# Altium project RBP-UPS_Power.PrjPcb
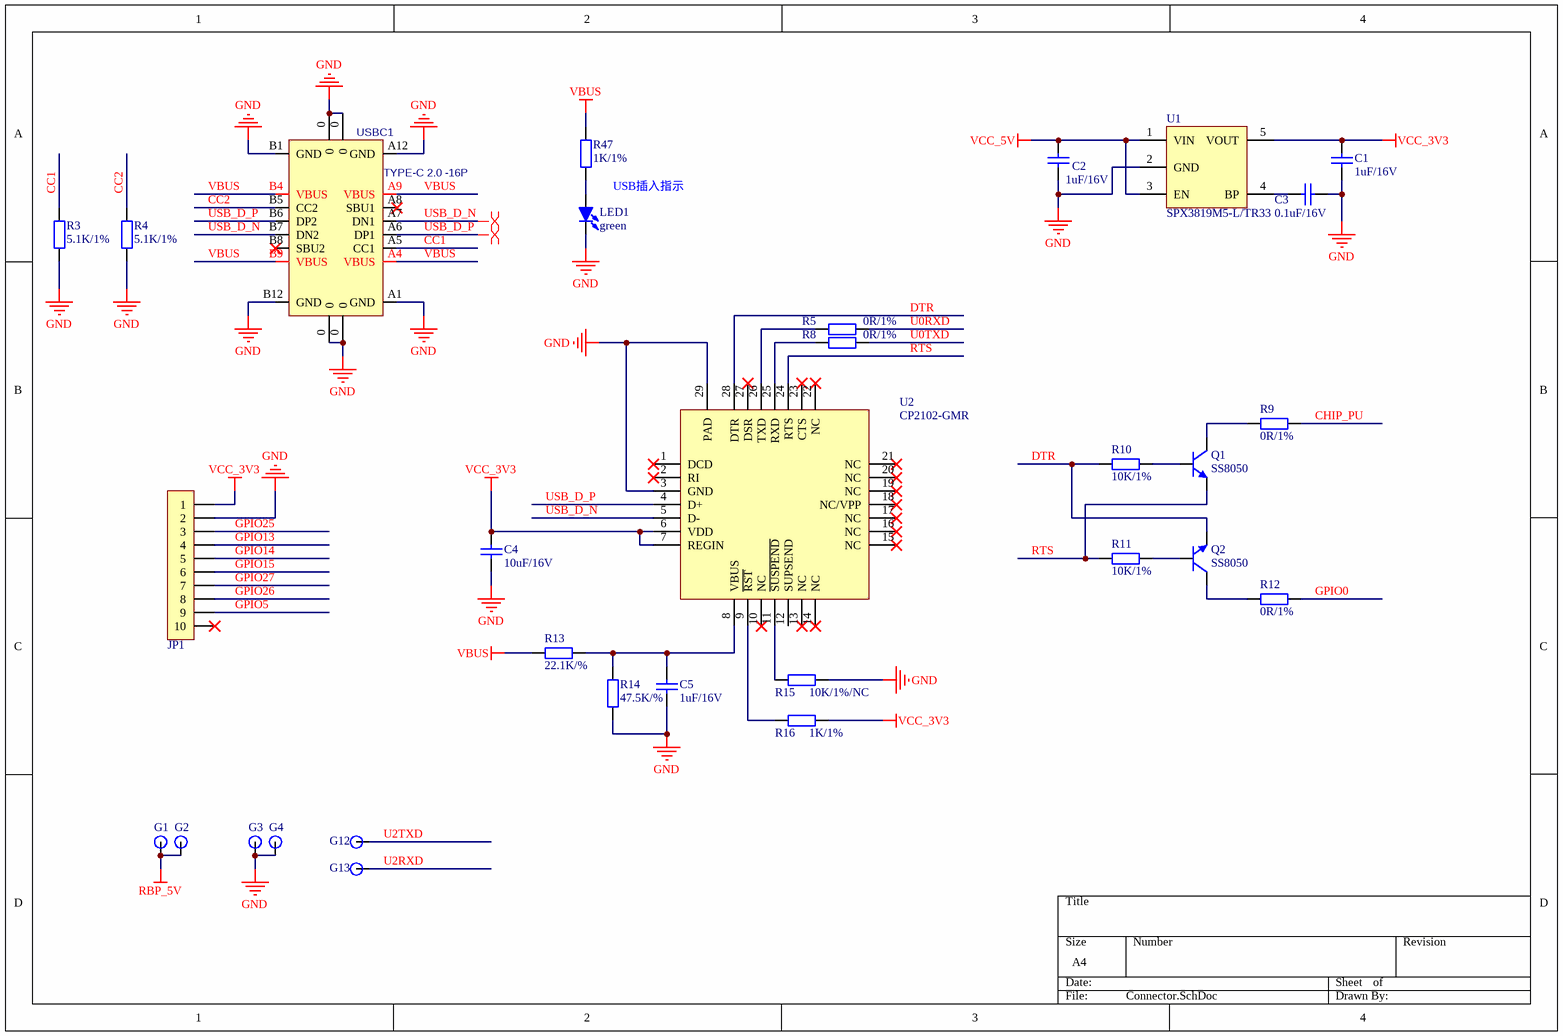
[diagram p0: Connector.SchDoc]
7 sheets, 156 parts. Net scope: global (net labels, ports and power ports of the same name join across sheets).
Board files: RBP-UPS_Power_V1.1.PcbDoc, RBP-UPS_Power_V1.2.PcbDoc
Sheets:
  Connector.SchDoc
  BatteryCharge.SchDoc
  Boost.SchDoc
  MCU.SchDoc
  OVP_OCP.SchDoc
  PowerDetective.SchDoc
  CW2015.SchDoc

## Sheet Connector.SchDoc
size A4

### Parts
C1  1uF/16V  [C0402_L]
C2  1uF/16V  [C0402_L]
C3  0.1uF/16V  [C0402_L]
C4  10uF/16V  [C0603_L]
C5  1uF/16V  [C0402_L]
G1  RBP_GPIO  [PA100-A3]  (value not drawn)
G2  RBP_GPIO  [PA100-A3]  (value not drawn)
G3  RBP_GPIO  [PA100-A3]  (value not drawn)
G4  RBP_GPIO  [PA100-A3]  (value not drawn)
G12  RBP_GPIO  [PA100-A3]  (value not drawn)
G13  RBP_GPIO  [PA100-A3]  (value not drawn)
JP1  CON-10P  [SH1.0-WT-10P]  (value not drawn)
LED1  green  [LED0402]
Q1  SS8050  [SOT23-3L]
Q2  SS8050  [SOT23-3L]
R3  5.1K/1%  [R0402_L]
R4  5.1K/1%  [R0402_L]
R5  0R/1%  [R0402_L]
R8  0R/1%  [R0402_L]
R9  0R/1%  [R0402_L]
R10  10K/1%  [R0402_L]
R11  10K/1%  [R0402_L]
R12  0R/1%  [R0402_L]
R13  22.1K/%  [R0402_L]
R14  47.5K/%  [R0402_L]
R15  10K/1%/NC  [R0402_L]
R16  1K/1%  [R0402_L]
R47  1K/1%  [R0402_L]
U1  SPX3819M5-L/TR33  [SOT23-5L]
U2  CP2102-GMR  [QFN28 5x5_L]
USBC1  TYPE-C 2.0 -16P  [USB-C-SMD_16P]

### Nets
GND: C1.2 C2.1 C3.2 C4.1 C5.1 G3.1 G4.1 JP1.2 LED1.2(K) R3.1 R4.1 R14.1 R15.2 U1.2(GND) U2.3(GND) U2.29(PAD) USBC1.0 USBC1.A1(GND) USBC1.A12(GND) USBC1.B1(GND) USBC1.B12(GND)
RBP_5V: G1.1 G2.1
VBUS: R13.1 R47.1 USBC1.A4(VBUS) USBC1.A9(VBUS) USBC1.B4(VBUS) USBC1.B9(VBUS)
VCC_3V3: C1.1 C4.2 JP1.1 R16.2 U1.5(VOUT) U2.6(VDD) U2.7(REGIN)
VCC_5V: C2.2 U1.1(VIN) U1.3(EN)
CC1: R3.2 USBC1.A5(CC1)
CC2: R4.2 USBC1.B5(CC2)
CHIP_PU: R9.2
DTR: Q2.2(E) R10.1 U2.28(DTR)
GPIO0: R12.2
GPIO5: JP1.9
GPIO13: JP1.4
GPIO14: JP1.5
GPIO15: JP1.6
GPIO25: JP1.3
GPIO26: JP1.8
GPIO27: JP1.7
RTS: Q1.2(E) R11.1 U2.24(RTS)
U0RXD: R5.2
U0TXD: R8.2
U2RXD: G13.1
U2TXD: G12.1
USB_D_N: U2.5(D-) USBC1.A7(DN1) USBC1.B7(DN2)
USB_D_P: U2.4(D+) USBC1.A6(DP1) USBC1.B6(DP2)
NetC3_1: C3.1 U1.4(BP)
NetC5_2: C5.2 R13.2 R14.2 U2.8(VBUS)
NetLED1_1: LED1.1(A) R47.2
NetQ1_1: Q1.1(B) R10.2
NetQ1_3: Q1.3(C) R9.1
NetQ2_1: Q2.1(B) R11.2
NetQ2_3: Q2.3(C) R12.1
NetR5_1: R5.1 U2.26(TXD)
NetR8_1: R8.1 U2.25(RXD)
NetR15_1: R15.1 U2.11(~{SUSPEND})
NetR16_1: R16.1 U2.9(~{RST})

Not connected (* = marked no-connect by the designer): JP1 10*; U2 1(DCD)* 2(RI)* 10(NC)* 12(SUPSEND) 13(NC)* 14(NC)* 15(NC)* 16(NC)* 17(NC)* 18(NC/VPP)* 19(NC)* 20(NC)* 21(NC)* 22(NC)* 23(CTS)* 27(DSR)*; USBC1 A8(SBU1)* B8(SBU2)*

### Layout directives
differential pair: USB_D_N, USB_D_P

### Notes on the sheet
- USB插入指示

### Library data of the parts
C1-C5 = C: 贴片电容; BOM名称: 无极性贴片电容; 联系卖家，免费查找封装: 唯一出售店铺网址https://shop463601444.taobao.com
JP1 = Header 10: 10P连接器; 联系卖家 免费查找封装: 唯一出售店铺网址https://shop463601444.taobao.com; 联系卖家 免费技术支持: 封装库来自淘宝卖家ID：黄晶宝石; BOM名称: 10P连接器
LED1 = LED-SMD: 贴片LED; 联系卖家 免费查找封装: 封装库来自淘宝卖家ID：黄晶宝石; BOM名称: 贴片LED
Q1 Q2 = 8050-SMD: 高频放大-NPN型; 联系卖家，免费查找封装: 唯一出售店铺网址https://shop463601444.taobao.com; 参数: 40V 1.5A 1W 100MHZ; BOM名称: 高频放大-NPN型
R3-R5 R8-R16 R47 = R: 贴片电阻; 联系卖家，免费查找封装: 唯一出售店铺网址https://shop463601444.taobao.com; BOM名称: 贴片电阻
U1 = SPX3819M5: 500ma-LDO
U2 = CP2102-GMR: USB-TTL
USBC1 = USB2.0_Type-C_16Pin: USB2.0_Type-C_16Pin母座; 联系卖家 免费查找封装: 唯一出售店铺网址https://shop463601444.taobao.com; 联系卖家 免费技术支持: 封装库来自淘宝卖家ID：黄晶宝石

## Sheet BatteryCharge.SchDoc
size A4
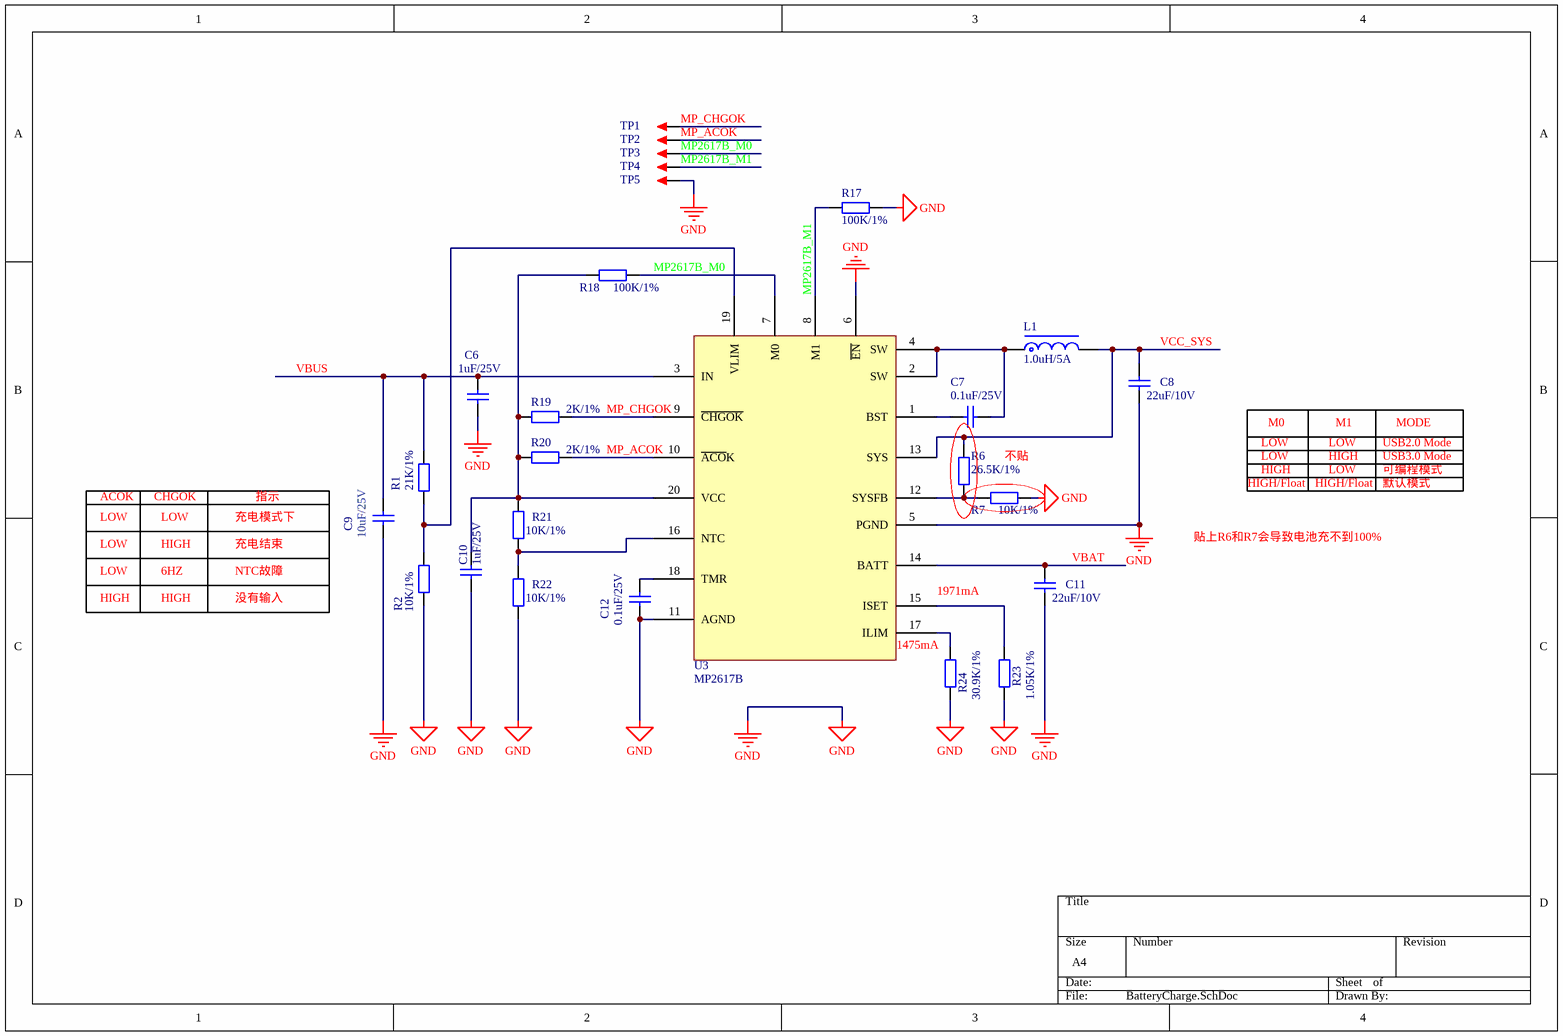
[diagram p1: BatteryCharge.SchDoc]

### Parts
C6  1uF/25V  [C0402_L]
C7  0.1uF/25V  [C0402_L]
C8  22uF/10V  [C0603_L]
C9  10uF/25V  [C0603_L]
C10  1uF/25V  [C0402_L]
C11  22uF/10V  [C0603_L]
C12  0.1uF/25V  [C0402_L]
L1  1.0uH/5A  [L-SMD-0630]
R1  21K/1%  [R0402_L]
R2  10K/1%  [R0402_L]
R6  26.5K/1%  [R0402_L]
R7  10K/1%  [R0402_L]
R17  100K/1%  [R0402_L]
R18  100K/1%  [R0402_L]
R19  2K/1%  [R0402_L]
R20  2K/1%  [R0402_L]
R21  10K/1%  [R0402_L]
R22  10K/1%  [R0402_L]
R23  1.05K/1%  [R0402_L]
R24  30.9K/1%  [R0402_L]
TP1  TEST  [TEST 1]  (value not drawn)
TP2  TEST  [TEST 1]  (value not drawn)
TP3  TEST  [TEST 1]  (value not drawn)
TP4  TEST  [TEST 1]  (value not drawn)
TP5  TEST  [TEST 1]  (value not drawn)
U3  MP2617B  [QFN-20]

### Nets
GND: C6.1 C8.1 C9.1 C10.1 C11.1 C12.2 R2.1 R7.2 R17.2 R22.1 R23.1 R24.1 TP5.1 U3.5(PGND) U3.6(~{EN}) U3.11(AGND)
VBAT: C11.2 U3.14(BATT)
VBUS: C6.2 C9.2 R1.2 U3.3(IN)
VCC_SYS: C8.2 L1.2 R6.2 U3.13(SYS)
MP2617B_M0: R18.2 TP3.1 U3.7(M0)
MP2617B_M1: R17.1 TP4.1 U3.8(M1)
MP_ACOK: R20.2 TP2.1 U3.10(~{ACO}K)
MP_CHGOK: R19.2 TP1.1 U3.9(~{CHGOK})
NetC7_1: C7.1 L1.1 U3.2(SW) U3.4(SW)
NetC7_2: C7.2 U3.1(BST)
NetC10_2: C10.2 R18.1 R19.1 R20.1 R21.2 U3.20(VCC)
NetC12_1: C12.1 U3.18(TMR)
NetR1_1: R1.1 R2.2 U3.19(VLIM)
NetR6_1: R6.1 R7.1 U3.12(SYSFB)
NetR21_1: R21.1 R22.2 U3.16(NTC)
NetR23_2: R23.2 U3.15(ISET)
NetR24_2: R24.2 U3.17(ILIM)

### Notes on the sheet
- LOW
- M0
- M1
- USB2.0 Mode
- MODE
- ACOK
- CHGOK
- 充电模式下
- 指示
- 不贴
- HIGH/Float
- HIGH
- USB3.0 Mode
- 可编程模式
- 默认模式
- 6HZ
- 充电结束
- NTC故障
- 贴上R6和R7会导致电池充不到100%
- 没有输入
- (near U3) 1475mA
- 1971mA

### Library data of the parts
C6-C12 = C: as C1 on sheet Connector
L1 = L-CDRH: CDRH功率屏蔽电感; BOM名称: 功率屏蔽电感; 联系卖家，免费查找封装: 唯一出售店铺网址https://shop463601444.taobao.com
R1 R2 R6 R7 R17-R24 = R: as R3 on sheet Connector; BOM名称: 贴片电阻
TP1-TP5 = TEST: 测试点; 联系卖家，免费查找封装: 唯一出售店铺网址https://shop463601444.taobao.com; 封装库来自淘宝卖家ID：黄晶宝石: 其他店铺购入均为盗版假冒封装库，请立即申请退款; BOM名称: 测试点
U3 = MP2617B: 锂电池充电IC，电源路径管理

## Sheet Boost.SchDoc
size A4
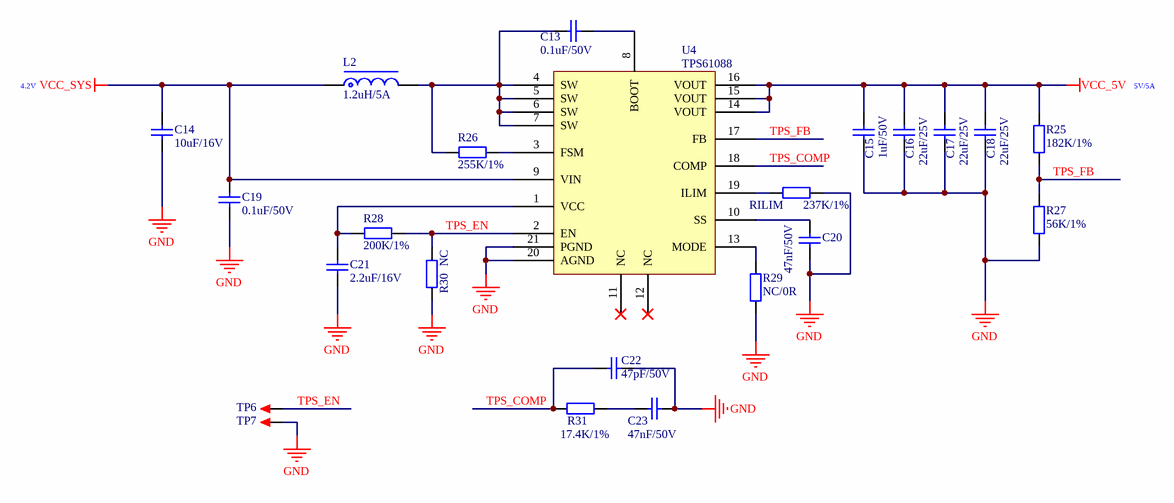
[diagram p2: Boost.SchDoc]

### Parts
C13  0.1uF/50V  [C0402_L]
C14  10uF/16V  [C0805_L]
C15  1uF/50V  [C0603_L]
C16  22uF/25V  [C1206_L]
C17  22uF/25V  [C1206_L]
C18  22uF/25V  [C1206_L]
C19  0.1uF/50V  [C0402_L]
C20  47nF/50V  [C0402_L]
C21  2.2uF/16V  [C0603_L]
C22  47pF/50V  [C0402_L]
C23  47nF/50V  [C0402_L]
L2  1.2uH/5A  [L-SMD-0630]
R25  182K/1%  [R0402_L]
R26  255K/1%  [R0402_L]
R27  56K/1%  [R0402_L]
R28  200K/1%  [R0402_L]
R29  NC/0R  [R0402_L]
R30  NC  [R0402_L]
R31  17.4K/1%  [R0402_L]
RILIM  237K/1%  [R0402_L]
TP6  TEST  [TEST 1]  (value not drawn)
TP7  TEST  [TEST 1]  (value not drawn)
U4  TPS61088  [VQFN-20]

### Nets
GND: C14.1 C15.1 C16.1 C17.1 C18.1 C19.1 C20.1 C21.1 C22.2 C23.2 R27.1 R29.1 R30.1 RILIM.2 TP7.1 U4.20(AGND) U4.21(PGND)
VCC_5V: C15.2 C16.2 C17.2 C18.2 R25.2 U4.14(VOUT) U4.15(VOUT) U4.16(VOUT)
VCC_SYS: C14.2 C19.2 L2.1 U4.9(VIN)
TPS_COMP: C22.1 R31.1 U4.18(COMP)
TPS_EN: R28.2 R30.2 TP6.1 U4.2(EN)
TPS_FB: R25.1 R27.2 U4.17(FB)
NetC13_1: C13.1 L2.2 R26.1 U4.4(SW) U4.5(SW) U4.6(SW) U4.7(SW)
NetC13_2: C13.2 U4.8(BOOT)
NetC20_2: C20.2 U4.10(SS)
NetC21_2: C21.2 R28.1 U4.1(VCC)
NetC23_1: C23.1 R31.2
NetR26_2: R26.2 U4.3(FSM)
NetR29_2: R29.2 U4.13(MODE)
NetRILIM_1: RILIM.1 U4.19(ILIM)

Not connected (* = marked no-connect by the designer): U4 11(NC)* 12(NC)*

### Notes on the sheet
- 4.2V
- 5V/5A

### Library data of the parts
C13-C23 = C: as C1 on sheet Connector
L2 = L-CDRH: 功率电感; BOM名称: 功率屏蔽电感; 联系卖家，免费查找封装: 唯一出售店铺网址https://shop463601444.taobao.com
R25-R31 RILIM = R: as R3 on sheet Connector; BOM名称: 贴片电阻
TP6 TP7 = TEST: as TP1 on sheet BatteryCharge; BOM名称: 测试点
U4 = TPS61088: 10A 全集成同步升压转换器

## Sheet MCU.SchDoc
size A4
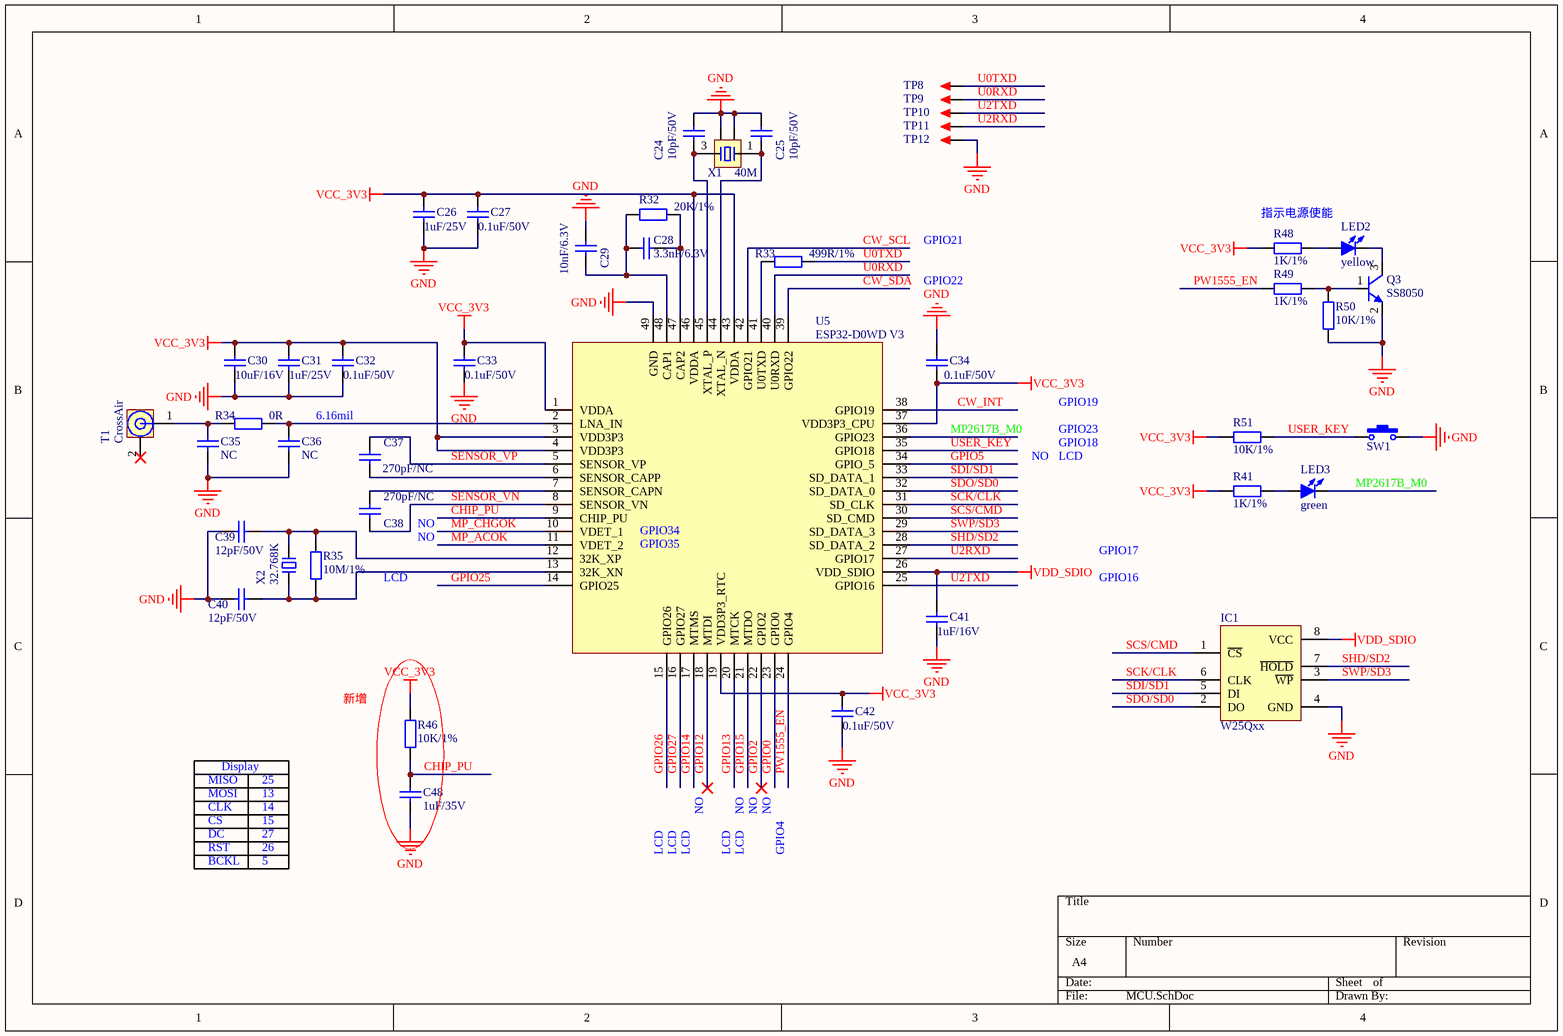
[diagram p3: MCU.SchDoc]

### Parts
(Parts that share a designator on the sheet are numbered #1, #2 ... from top to bottom, then left to right.)
C24  10pF/50V  [C0402_L]
C25  10pF/50V  [C0402_L]
C26  1uF/25V  [C0402_L]
C27  0.1uF/50V  [C0402_L]
C28  3.3nF/6.3V  [C0402_L]
C29  10nF/6.3V  [C0402_L]
C30  10uF/16V  [C0603_L]
C31  1uF/25V  [C0402_L]
C32  0.1uF/50V  [C0402_L]
C33  0.1uF/50V  [C0402_L]
C34  0.1uF/50V  [C0402_L]
C35  NC  [C0402_L]
C36  NC  [C0402_L]
C37  270pF/NC  [C0402_L]
C38  270pF/NC  [C0402_L]
C39  12pF/50V  [C0402_L]
C40  12pF/50V  [C0402_L]
C41  1uF/16V  [C0402_L]
C42  0.1uF/50V  [C0402_L]
C48  1uF/35V  [C0402_L]
IC1  W25Qxx  [SOP8W_L]
LED2  yellow  [LED0402]
LED3  green  [LED0402]
Q3  SS8050  [SOT23-3L]
R32  20K/1%  [R0402_L]
R33  499R/1%  [R0402_L]
R34  0R  [R0402_L]
R35  10M/1%  [R0402_L]
R41#1  1K/1%  [R0402_L]
R46  10K/1%  [R0402_L]
R48  1K/1%  [R0402_L]
R49  1K/1%  [R0402_L]
R50  10K/1%  [R0402_L]
R51  10K/1%  [R0402_L]
SW1  小龟侧按3x4  [小龟开关侧按键2脚贴片]  (value not drawn)
T1  CrossAir  [CA-C03]
TP8  TEST  [TEST 1]  (value not drawn)
TP9  TEST  [TEST 1]  (value not drawn)
TP10  TEST  [TEST 1]  (value not drawn)
TP11  TEST  [TEST 1]  (value not drawn)
TP12  TEST  [TEST 1]  (value not drawn)
U5  ESP32-D0WD V3  [QFN48_ESP32]
X1  40M  [XTAL-3225-4P]
X2  32.768K  [XTAL-3215-2P]

### Nets
GND: C24.2 C25.2 C26.1 C27.1 C29.2 C30.1 C31.1 C32.1 C33.1 C34.2 C35.1 C36.1 C39.1 C40.1 C41.1 C42.1 C48.1 IC1.4(GND) Q3.2(E) R50.1 SW1.2 TP12.1 U5.49(GND) X1.2 X1.4
VCC_3V3: C26.2 C27.2 C30.2 C31.2 C32.2 C33.2 C34.1 C42.2 R41#1.1 R46.2 R48.2 R51.1 U5.1(VDDA) U5.3(VDD3P3) U5.4(VDD3P3) U5.19(VDD3P3_RTC) U5.37(VDD3P3_CPU) U5.43(VDDA) U5.46(VDDA)
VDD_SDIO: C41.2 IC1.8(VCC) U5.26(VDD_SDIO)
CHIP_PU: C48.2 R46.1 U5.9(CHIP_PU)
CW_INT: U5.38(GPIO19)
CW_SCL: U5.42(GPIO21)
CW_SDA: U5.39(GPIO22)
GPIO0: U5.23(GPIO0)
GPIO2: U5.22(GPIO2)
GPIO5: U5.34(GPIO_5)
GPIO12: U5.18(MTDI)
GPIO13: U5.20(MTCK)
GPIO14: U5.17(MTMS)
GPIO15: U5.21(MTDO)
GPIO25: U5.14(GPIO25)
GPIO26: U5.15(GPIO26)
GPIO27: U5.16(GPIO27)
MP2617B_M0: LED3.2(K) U5.36(GPIO23)
MP_ACOK: U5.11(VDET_2)
MP_CHGOK: U5.10(VDET_1)
PW1555_EN: R49.1 U5.24(GPIO4)
SCK/CLK: IC1.6(CLK) U5.31(SD_CLK)
SCS/CMD: IC1.1(~{CS}) U5.30(SD_CMD)
SDI/SD1: IC1.5(DI) U5.33(SD_DATA_1)
SDO/SD0: IC1.2(DO) U5.32(SD_DATA_0)
SENSOR_VN: C38.1 U5.8(SENSOR_VN)
SENSOR_VP: C37.2 U5.5(SENSOR_VP)
SHD/SD2: IC1.7(~{HOLD}) U5.28(SD_DATA_2)
SWP/SD3: IC1.3(~{WP}) U5.29(SD_DATA_3)
U0RXD: TP9.1 U5.40(U0RXD)
U0TXD: R33.2 TP8.1
U2RXD: TP11.1 U5.27(GPIO17)
U2TXD: TP10.1 U5.25(GPIO16)
USER_KEY: R51.2 SW1.1 U5.35(GPIO18)
NetC24_1: C24.1 U5.45(XTAL_P) X1.3
NetC25_1: C25.1 U5.44(XTAL_N) X1.1
NetC28_1: C28.1 C29.1 R32.1 U5.48(CAP1)
NetC28_2: C28.2 R32.2 U5.47(CAP2)
NetC35_2: C35.2 R34.1 T1.1
NetC36_2: C36.2 R34.2 U5.2(LNA_IN)
NetC37_1: C37.1 U5.6(SENSOR_CAPP)
NetC38_2: C38.2 U5.7(SENSOR_CAPN)
NetC39_2: C39.2 R35.2 U5.12(32K_XP) X2.2
NetC40_2: C40.2 R35.1 U5.13(32K_XN) X2.1
NetLED2_1: LED2.1(A) R48.1
NetLED2_2: LED2.2(K) Q3.3(C)
NetLED3_1: LED3.1(A) R41#1.2
NetQ3_1: Q3.1(B) R49.2 R50.2
NetR33_1: R33.1 U5.41(U0TXD)

Not connected (* = marked no-connect by the designer): T1 2*

### Notes on the sheet
- GPIO21
- (near R48) 指示电源使能
- GPIO22
- 6.16mil
- GPIO19
- GPIO23
- GPIO18
- NO
- LCD
- (near C38) NO
- (near U5) GPIO34
- (near U5) GPIO35
- GPIO16
- GPIO17
- 新增
- MISO
- Display
- 25
- MOSI
- CLK
- CS
- DC
- RST
- 13
- 14
- 15
- 27
- 26
- GPIO4
- BCKL
- 5

### Library data of the parts
C24-C42 C48 = C: as C1 on sheet Connector
IC1 = W25Q: SPI Flash; BOM名称: 外置Flash; 联系卖家，免费查找封装: 唯一出售店铺网址https://shop463601444.taobao.com; 封装库来自淘宝卖家ID：黄晶宝石: 其他店铺购入均为盗版假冒封装库，请立即申请退款
LED2 LED3 = LED-SMD: 贴片LED; 联系卖家 免费查找封装: 封装库来自淘宝卖家ID：黄晶宝石; BOM名称: 贴片LED
Q3 = 8050-SMD: as Q1 on sheet Connector; BOM名称: 高频放大-NPN型
R32-R35 R41#1 R46 R48-R51 = R: as R3 on sheet Connector; BOM名称: 贴片电阻
SW1 = SW-PB: 微动开关; BOM名称: 3x6轻触开关; 联系卖家，免费查找封装: 唯一出售店铺网址https://shop463601444.taobao.com; 封装库来自淘宝卖家ID：黄晶宝石: 其他店铺购入均为盗版假冒封装库，请立即申请退款
T1 = CrossAir: 天线
TP8-TP12 = TEST: as TP1 on sheet BatteryCharge; BOM名称: 测试点
U5 = ESP32-D0WD V3: ESP32
X1 = XTAL-4P: 4脚无源晶振(谐振器）; 联系卖家，免费查找封装: 唯一出售店铺网址https://shop463601444.taobao.com; BOM名称: 4脚无源晶振(谐振器）
X2 = XTAL-2P: 2脚无源晶振(谐振器）; 联系卖家，免费查找封装: 唯一出售店铺网址https://shop463601444.taobao.com; BOM名称: 2脚无源晶振(谐振器）

## Sheet OVP_OCP.SchDoc
size A4
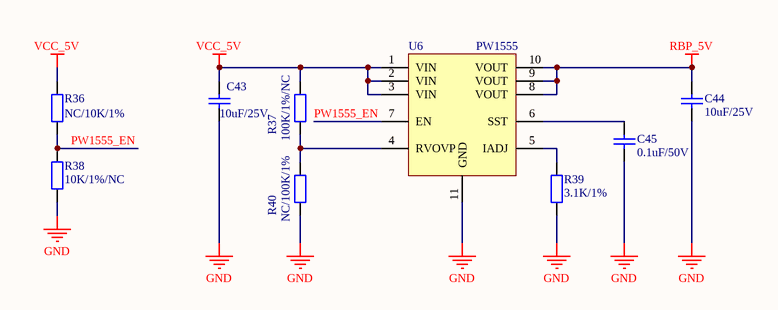
[diagram p4: OVP_OCP.SchDoc]

### Parts
C43  10uF/25V  [C0805_L]
C44  10uF/25V  [C0805_L]
C45  0.1uF/50V  [C0402_L]
R36  NC/10K/1%  [R0402_L]
R37  100K/1%/NC  [R0402_L]
R38  10K/1%/NC  [R0402_L]
R39  3.1K/1%  [R0402_L]
R40  NC/100K/1%  [R0402_L]
U6  PW1555  [DFN3x3-10]

### Nets
GND: C43.1 C44.1 C45.1 R38.1 R39.1 R40.1 U6.11(GND)
RBP_5V: C44.2 U6.8(VOUT) U6.9(VOUT) U6.10(VOUT)
VCC_5V: C43.2 R36.2 R37.2 U6.1(VIN) U6.2(VIN) U6.3(VIN)
PW1555_EN: R36.1 R38.2 U6.7(EN)
NetC45_2: C45.2 U6.6(SST)
NetR37_1: R37.1 R40.2 U6.4(RVOVP)
NetR39_2: R39.2 U6.5(IADJ)

### Library data of the parts
C43-C45 = C: as C1 on sheet Connector
R36-R40 = R: as R3 on sheet Connector; BOM名称: 贴片电阻
U6 = PW1555: VOVP  ILIM保护芯片

## Sheet PowerDetective.SchDoc
size A4
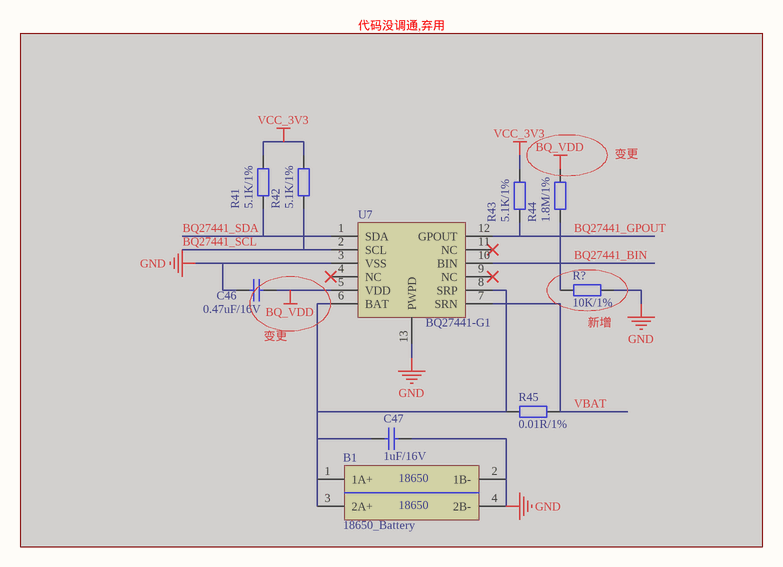
[diagram p5: PowerDetective.SchDoc]

### Parts
(Parts that share a designator on the sheet are numbered #1, #2 ... from top to bottom, then left to right.)
B1#1  18650_Battery  [18650*2]  (masked out: inside a compile mask, not in the netlist)
C46#1  0.47uF/16V  [C0402_L]  (masked out: inside a compile mask, not in the netlist)
C47#1  1uF/16V  [C0402_L]  (masked out: inside a compile mask, not in the netlist)
R41#2  5.1K/1%  [R0402_L]  (masked out: inside a compile mask, not in the netlist)
R42#1  5.1K/1%  [R0402_L]  (masked out: inside a compile mask, not in the netlist)
R43#1  5.1K/1%  [R0402_L]  (masked out: inside a compile mask, not in the netlist)
R44#1  1.8M/1%  [R0402_L]  (masked out: inside a compile mask, not in the netlist)
R45#1  0.01R/1%  [R1206_L]  (masked out: inside a compile mask, not in the netlist)
R?  10K/1%  [R0402_L]  (masked out: inside a compile mask, not in the netlist)
U7#1  BQ27441-G1  [VSON-12]  (masked out: inside a compile mask, not in the netlist)

### Notes on the sheet
- 代码没调通,弃用
- 变更
- (near C46#1) 变更
- (near R?) 新增
- (in symbol 18650_Battery) 18650

### Library data of the parts
B1#1 = 18650_Battery: 18650电池盒
C46#1 C47#1 = C: as C1 on sheet Connector
R41#2 R42#1 R43#1 R44#1 R45#1 R? = R: as R3 on sheet Connector; BOM名称: 贴片电阻
U7#1 = BQ27441: 电量监测计

## Sheet CW2015.SchDoc
size A4
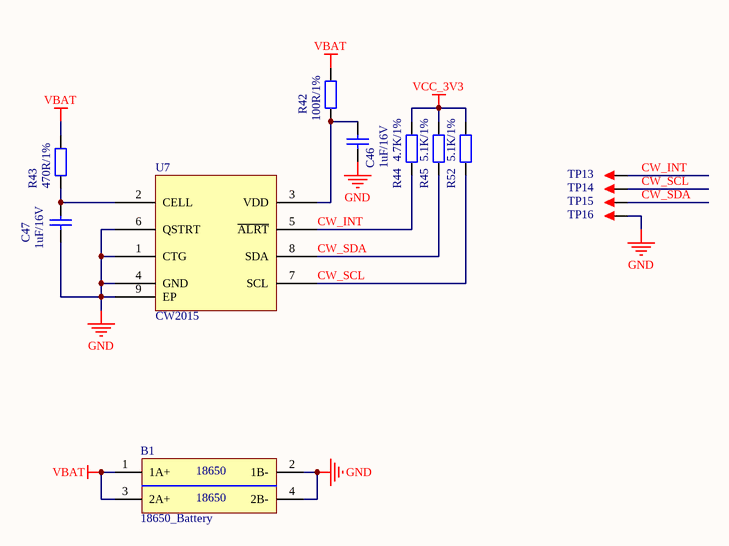
[diagram p6: CW2015.SchDoc]

### Parts
(Parts that share a designator on the sheet are numbered #1, #2 ... from top to bottom, then left to right.)
B1#2  18650_Battery  [18650*2]
C46#2  1uF/16V  [C0402_L]
C47#2  1uF/16V  [C0402_L]
R42#2  100R/1%  [R0402_L]
R43#2  470R/1%  [R0402_L]
R44#2  4.7K/1%  [R0402_L]
R45#2  5.1K/1%  [R0402_L]
R52  5.1K/1%  [R0402_L]
TP13  TEST  [TEST 1]  (value not drawn)
TP14  TEST  [TEST 1]  (value not drawn)
TP15  TEST  [TEST 1]  (value not drawn)
TP16  TEST  [TEST 1]  (value not drawn)
U7#2  CW2015  [CW2015]

### Nets
GND: B1#2.2(1B-) B1#2.4(2B-) C46#2.2 C47#2.1 TP16.1 U7#2.1(CTG) U7#2.4(GND) U7#2.6(QSTRT) U7#2.9(EP)
VBAT: B1#2.1(1A+) B1#2.3(2A+) R42#2.2 R43#2.2
VCC_3V3: R44#2.2 R45#2.2 R52.2
CW_INT: R44#2.1 TP13.1 U7#2.5(~{ALRT})
CW_SCL: R52.1 TP14.1 U7#2.7(SCL)
CW_SDA: R45#2.1 TP15.1 U7#2.8(SDA)
NetC46#2_1: C46#2.1 R42#2.1 U7#2.3(VDD)
NetC47#2_2: C47#2.2 R43#2.1 U7#2.2(CELL)

### Notes on the sheet
- (in symbol 18650_Battery) 18650

### Library data of the parts
B1#2 = 18650_Battery: 18650电池盒
C46#2 C47#2 = C: as C1 on sheet Connector
R42#2 R43#2 R44#2 R45#2 R52 = R: as R3 on sheet Connector; BOM名称: 贴片电阻
TP13-TP16 = TEST: as TP1 on sheet BatteryCharge; BOM名称: 测试点
U7#2 = CW2015: 电量计

## Nets that join several sheets
GND: Connector (21 pins), BatteryCharge (16 pins), Boost (17 pins), MCU (25 pins), OVP_OCP (7 pins), CW2015 (9 pins)
RBP_5V: Connector (G1.1 G2.1), OVP_OCP (C44.2 U6.8 U6.9 U6.10)
VBAT: BatteryCharge (C11.2 U3.14), CW2015 (B1#2.1 B1#2.3 R42#2.2 R43#2.2)
VBUS: Connector (6 pins), BatteryCharge (C6.2 C9.2 R1.2 U3.3)
VCC_3V3: Connector (7 pins), MCU (19 pins), CW2015 (R44#2.2 R45#2.2 R52.2)
VCC_5V: Connector (C2.2 U1.1 U1.3), Boost (8 pins), OVP_OCP (6 pins)
VCC_SYS: BatteryCharge (C8.2 L1.2 R6.2 U3.13), Boost (C14.2 C19.2 L2.1 U4.9)
CHIP_PU: Connector (R9.2), MCU (C48.2 R46.1 U5.9)
CW_INT: MCU (U5.38), CW2015 (R44#2.1 TP13.1 U7#2.5)
CW_SCL: MCU (U5.42), CW2015 (R52.1 TP14.1 U7#2.7)
CW_SDA: MCU (U5.39), CW2015 (R45#2.1 TP15.1 U7#2.8)
GPIO0: Connector (R12.2), MCU (U5.23)
GPIO5: Connector (JP1.9), MCU (U5.34)
GPIO13: Connector (JP1.4), MCU (U5.20)
GPIO14: Connector (JP1.5), MCU (U5.17)
GPIO15: Connector (JP1.6), MCU (U5.21)
GPIO25: Connector (JP1.3), MCU (U5.14)
GPIO26: Connector (JP1.8), MCU (U5.15)
GPIO27: Connector (JP1.7), MCU (U5.16)
MP2617B_M0: BatteryCharge (R18.2 TP3.1 U3.7), MCU (LED3.2 U5.36)
MP_ACOK: BatteryCharge (R20.2 TP2.1 U3.10), MCU (U5.11)
MP_CHGOK: BatteryCharge (R19.2 TP1.1 U3.9), MCU (U5.10)
PW1555_EN: MCU (R49.1 U5.24), OVP_OCP (R36.1 R38.2 U6.7)
U0RXD: Connector (R5.2), MCU (TP9.1 U5.40)
U0TXD: Connector (R8.2), MCU (R33.2 TP8.1)
U2RXD: Connector (G13.1), MCU (TP11.1 U5.27)
U2TXD: Connector (G12.1), MCU (TP10.1 U5.25)